# Altium schematic sheet 0269_GPU_VCCGT VREG PHA.SchDoc
size 848 x 558 mm
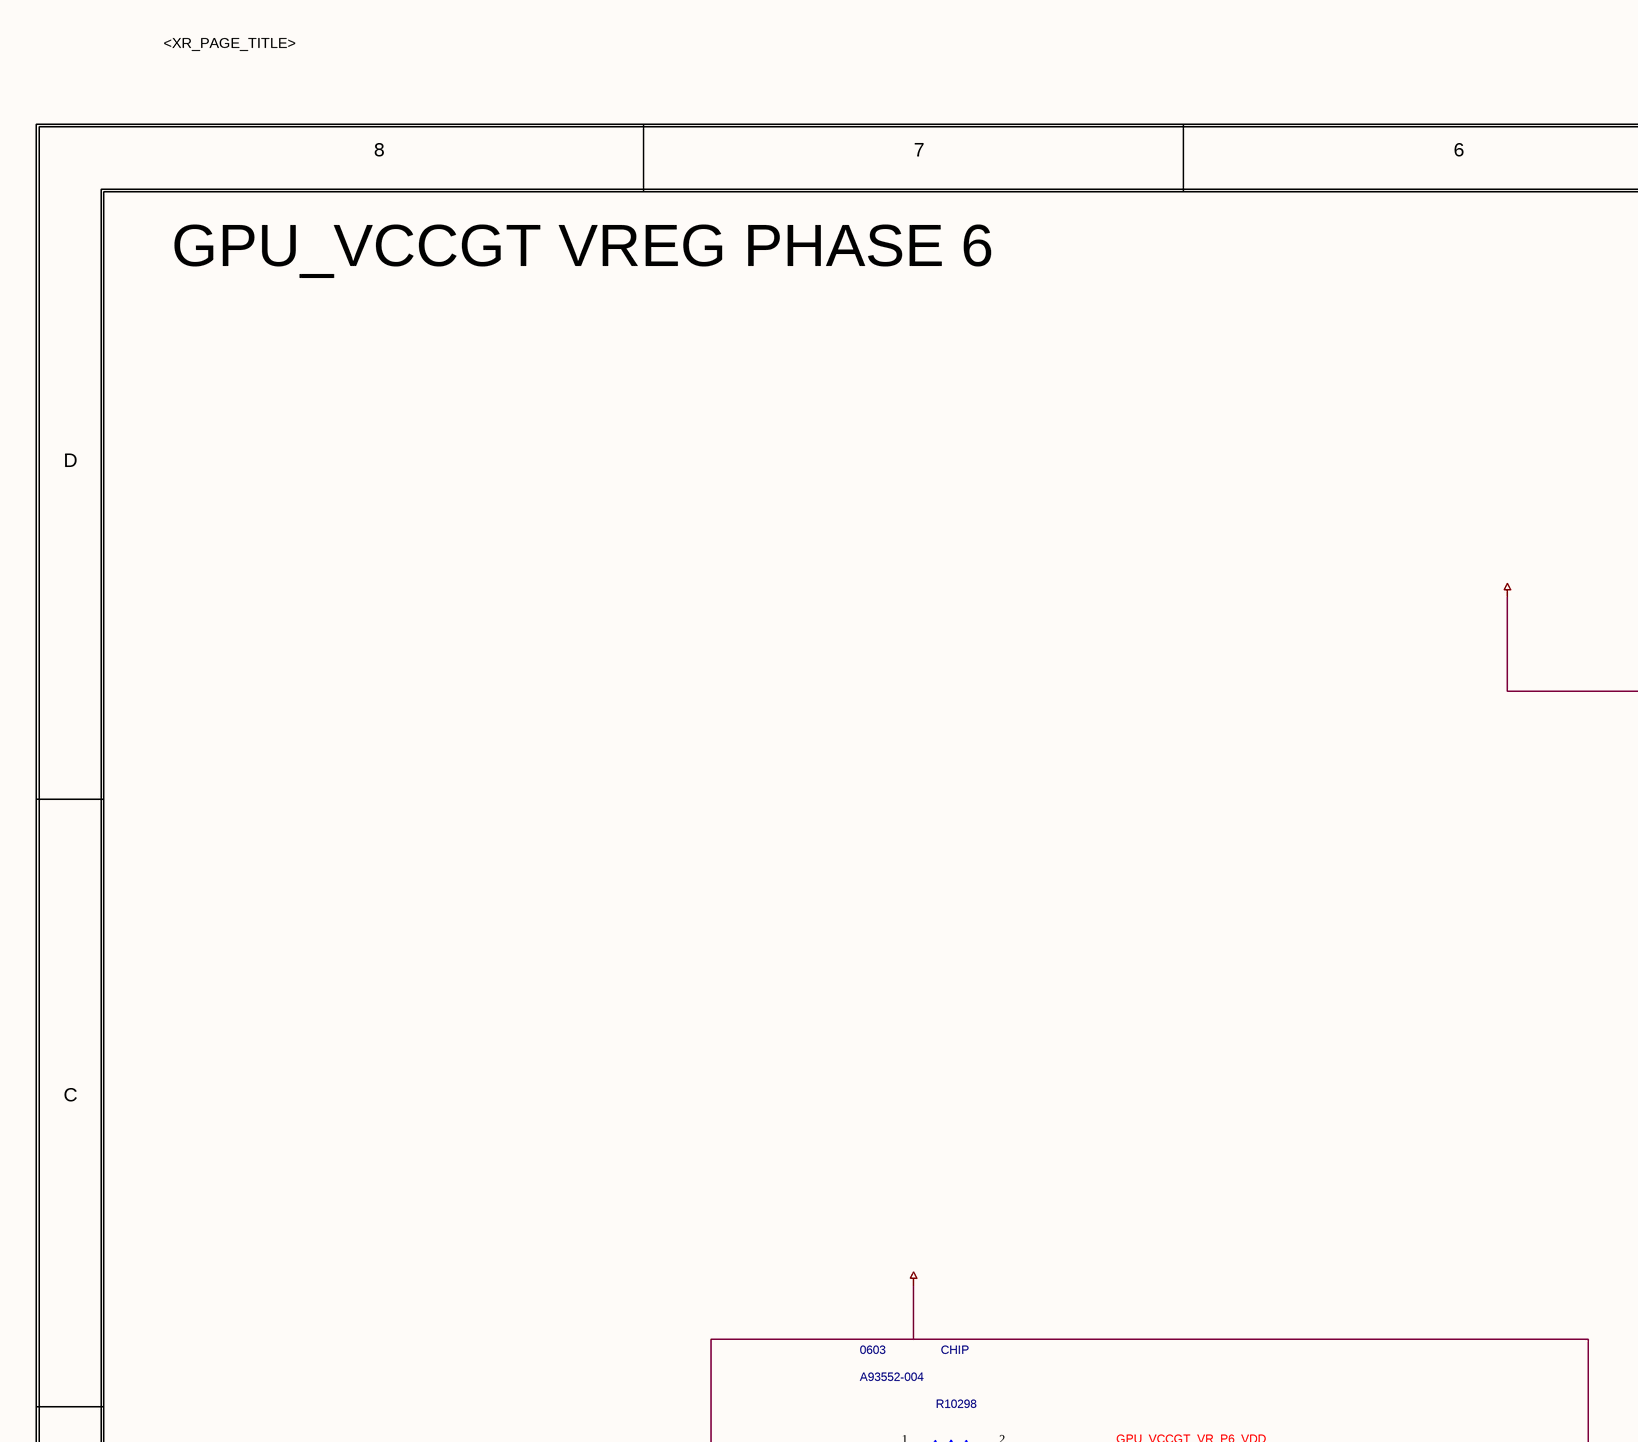
[diagram p0: 0269_GPU_VCCGT VREG PHA.SchDoc, top left]
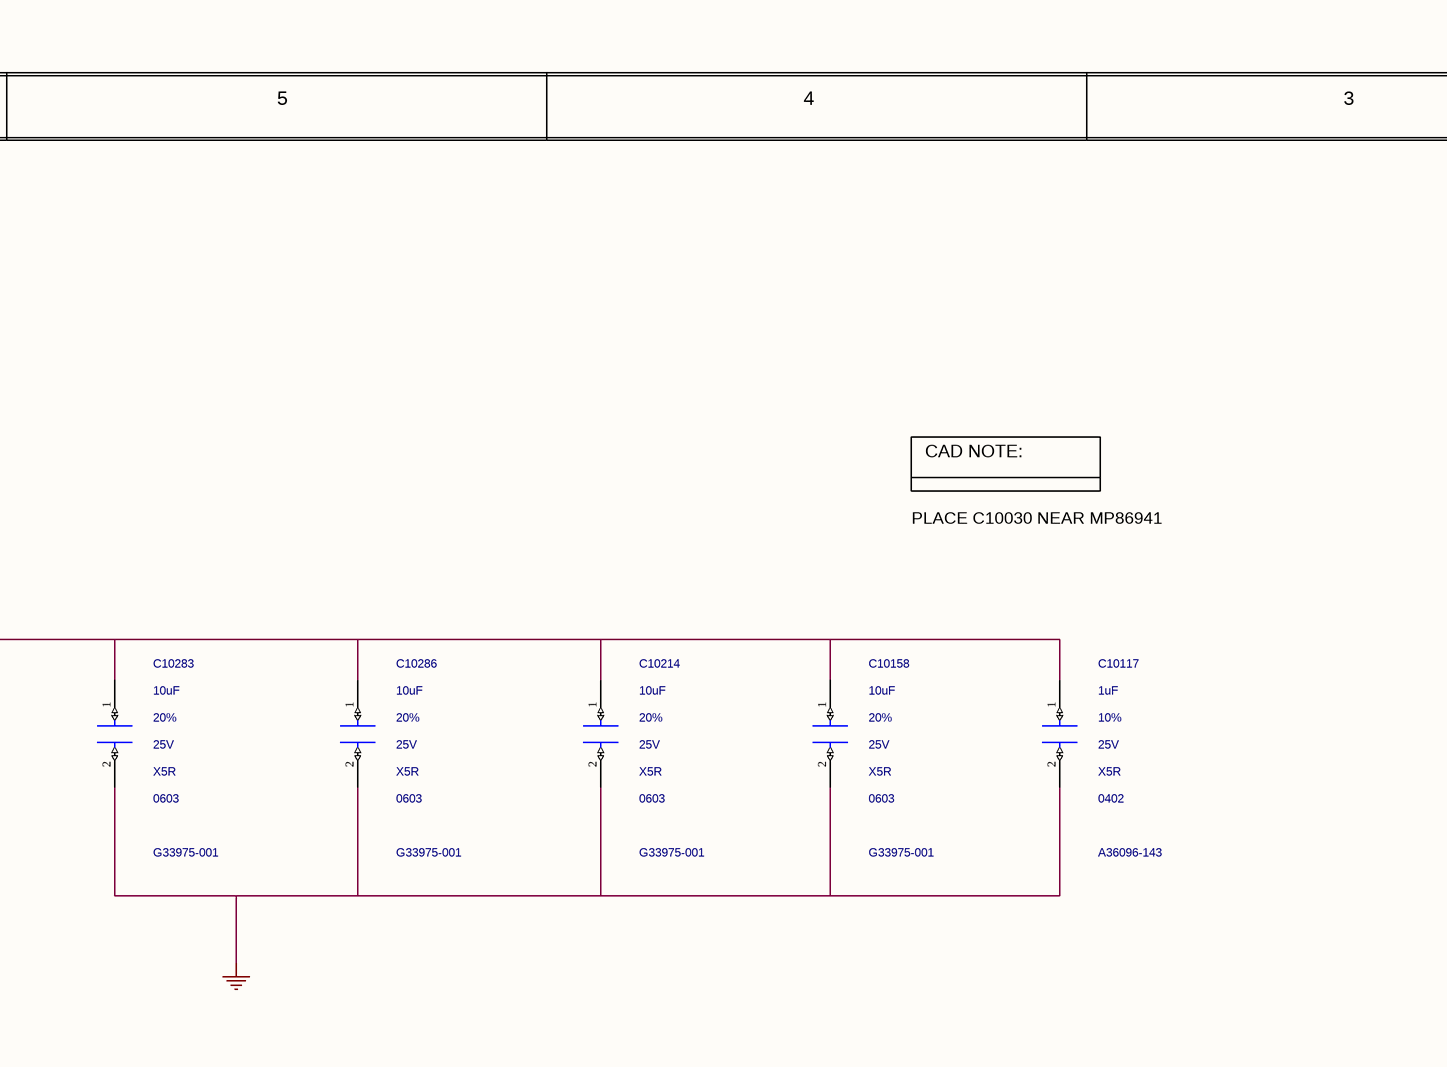
[diagram p1: 0269_GPU_VCCGT VREG PHA.SchDoc, top middle]
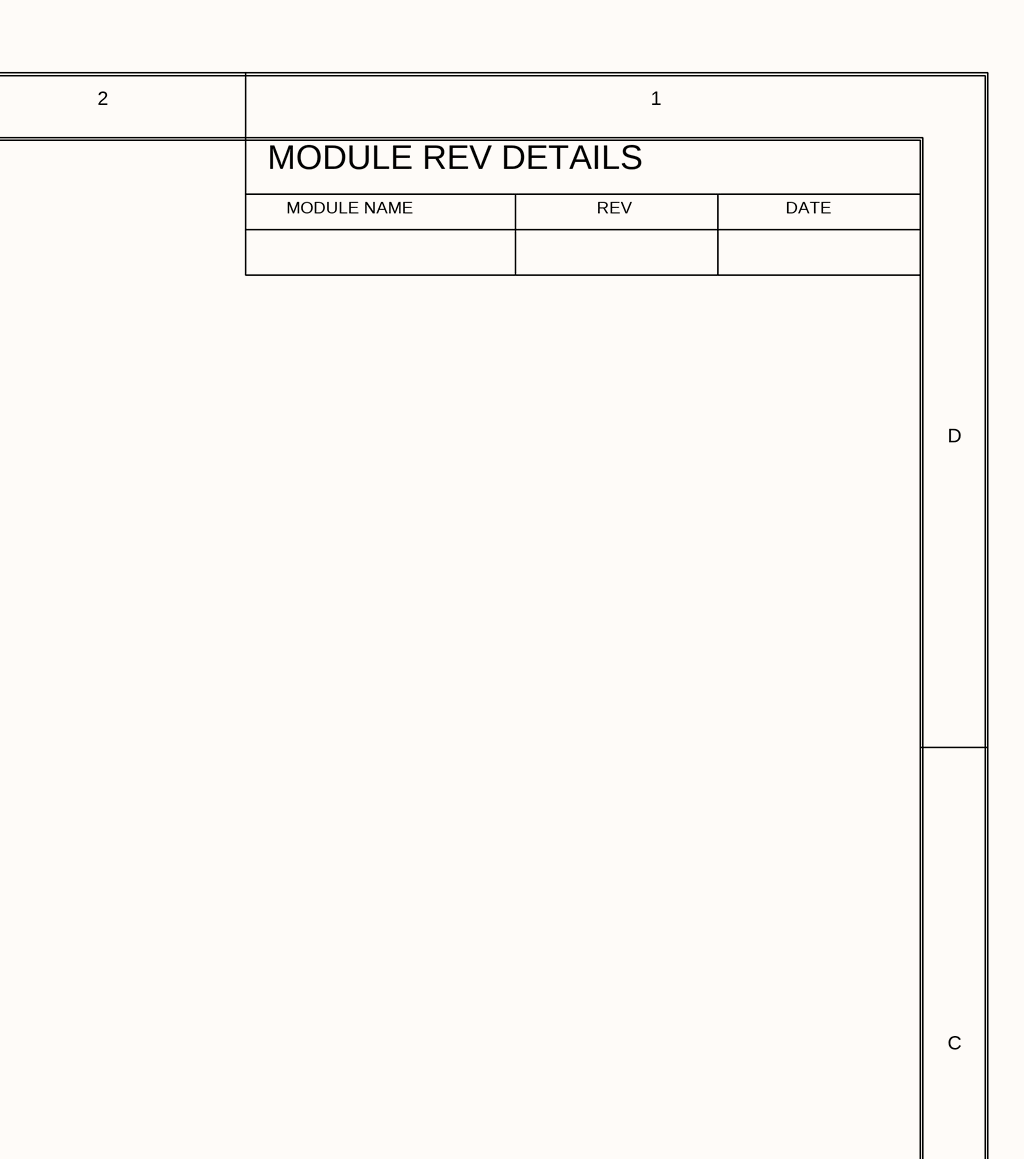
[diagram p2: 0269_GPU_VCCGT VREG PHA.SchDoc, top right]
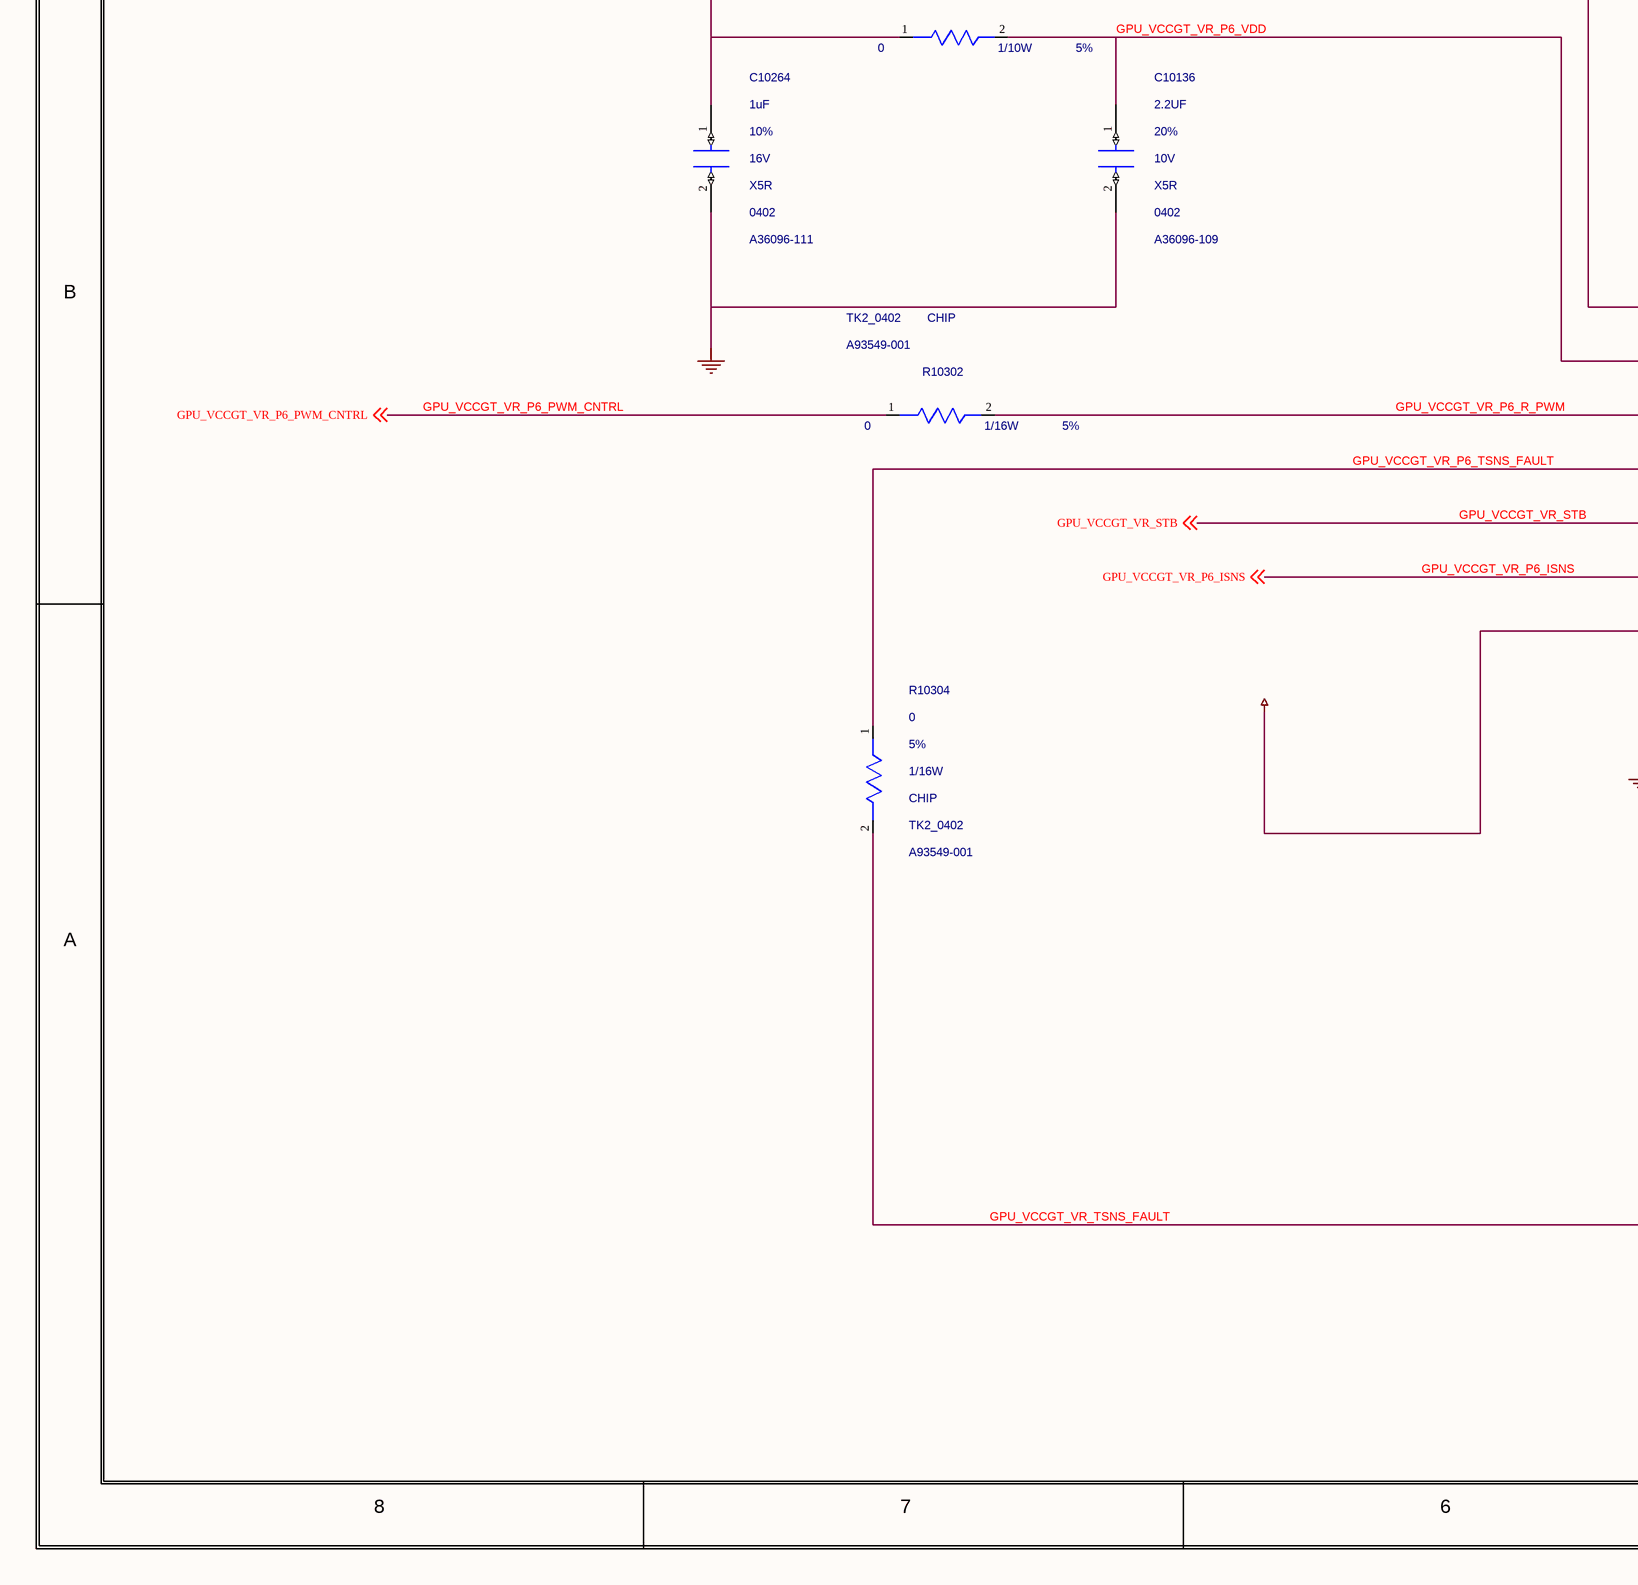
[diagram p3: 0269_GPU_VCCGT VREG PHA.SchDoc, bottom left]
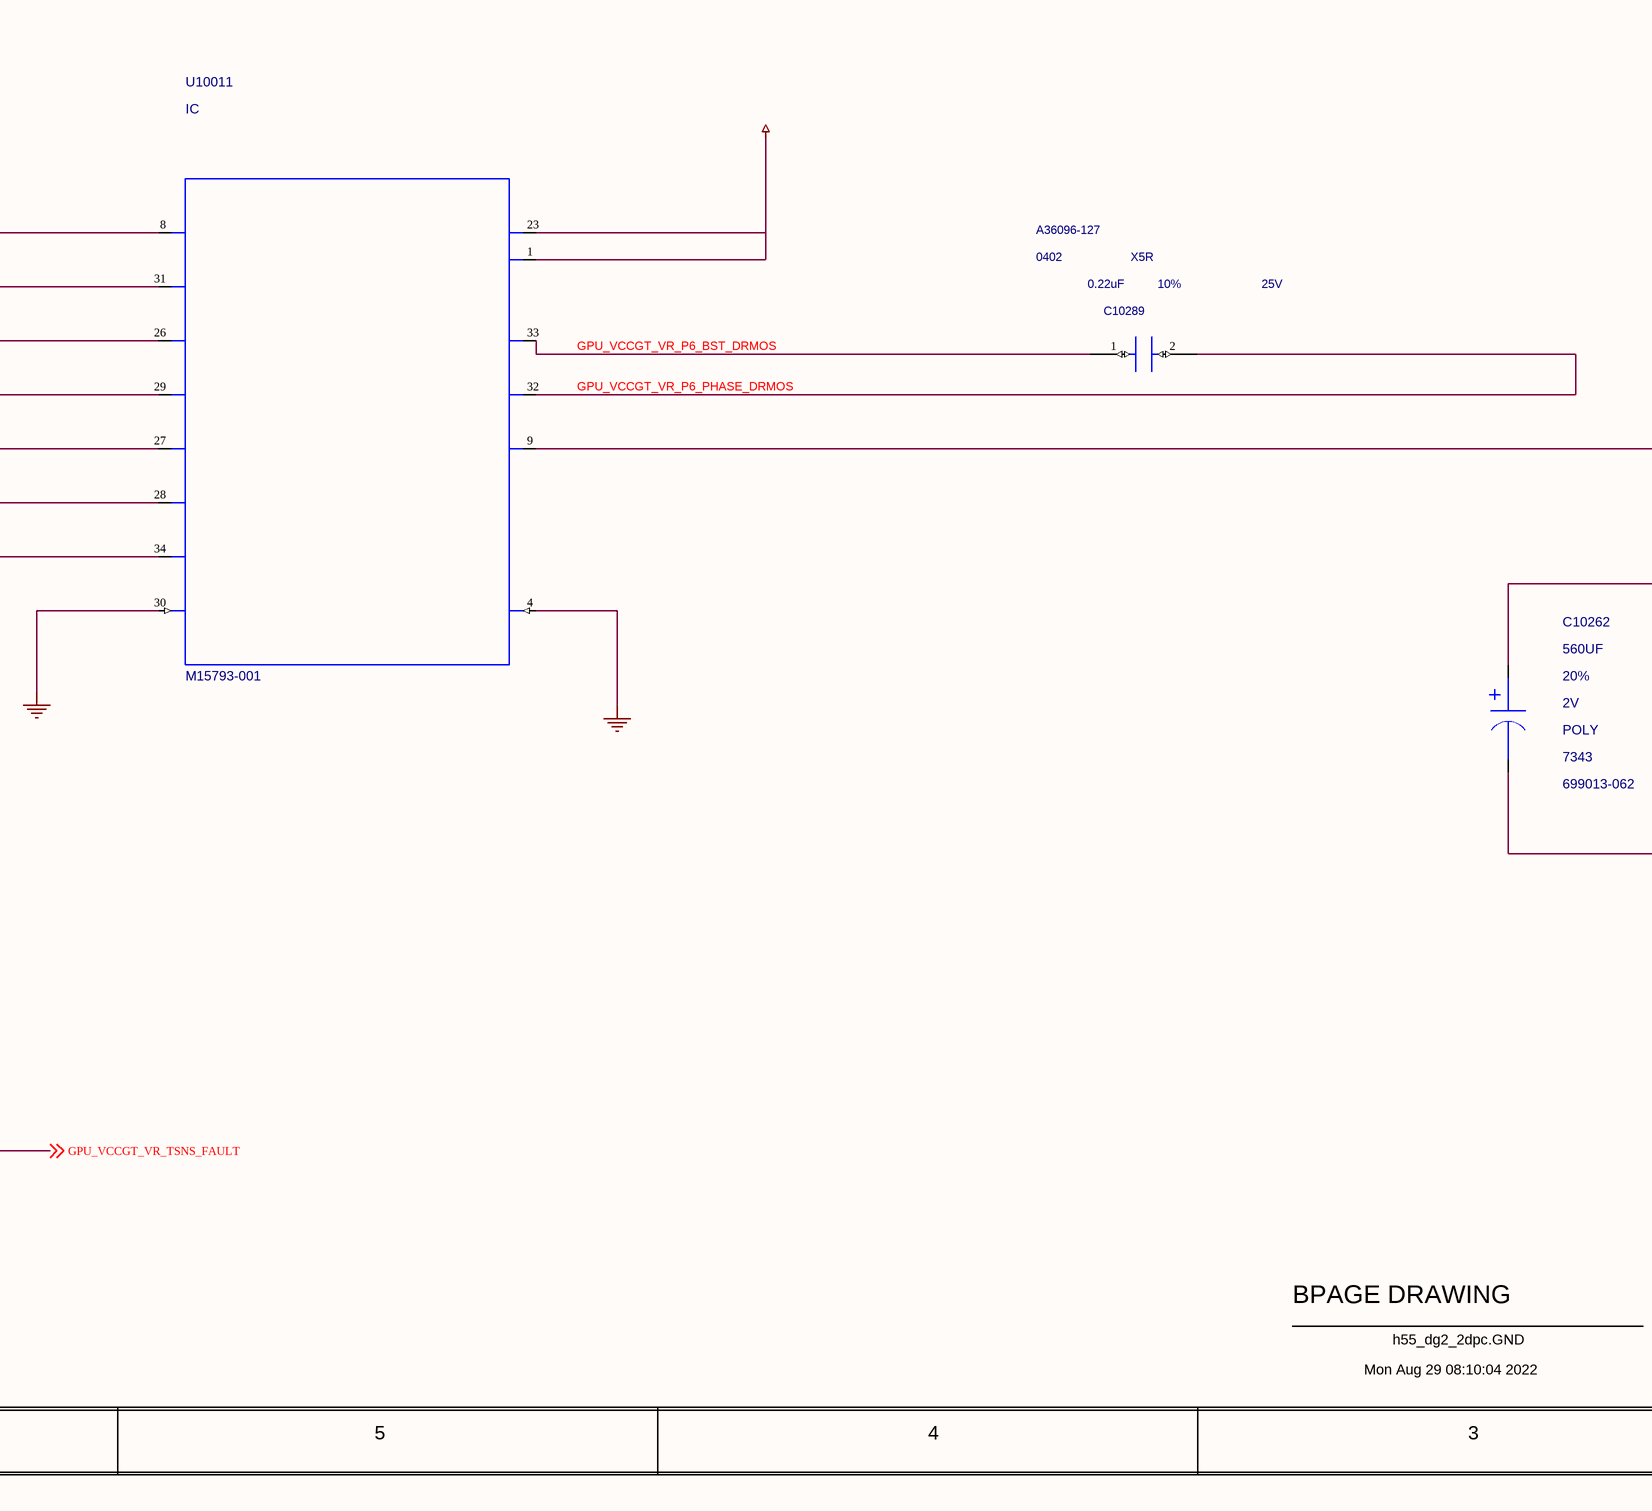
[diagram p4: 0269_GPU_VCCGT VREG PHA.SchDoc, bottom middle]
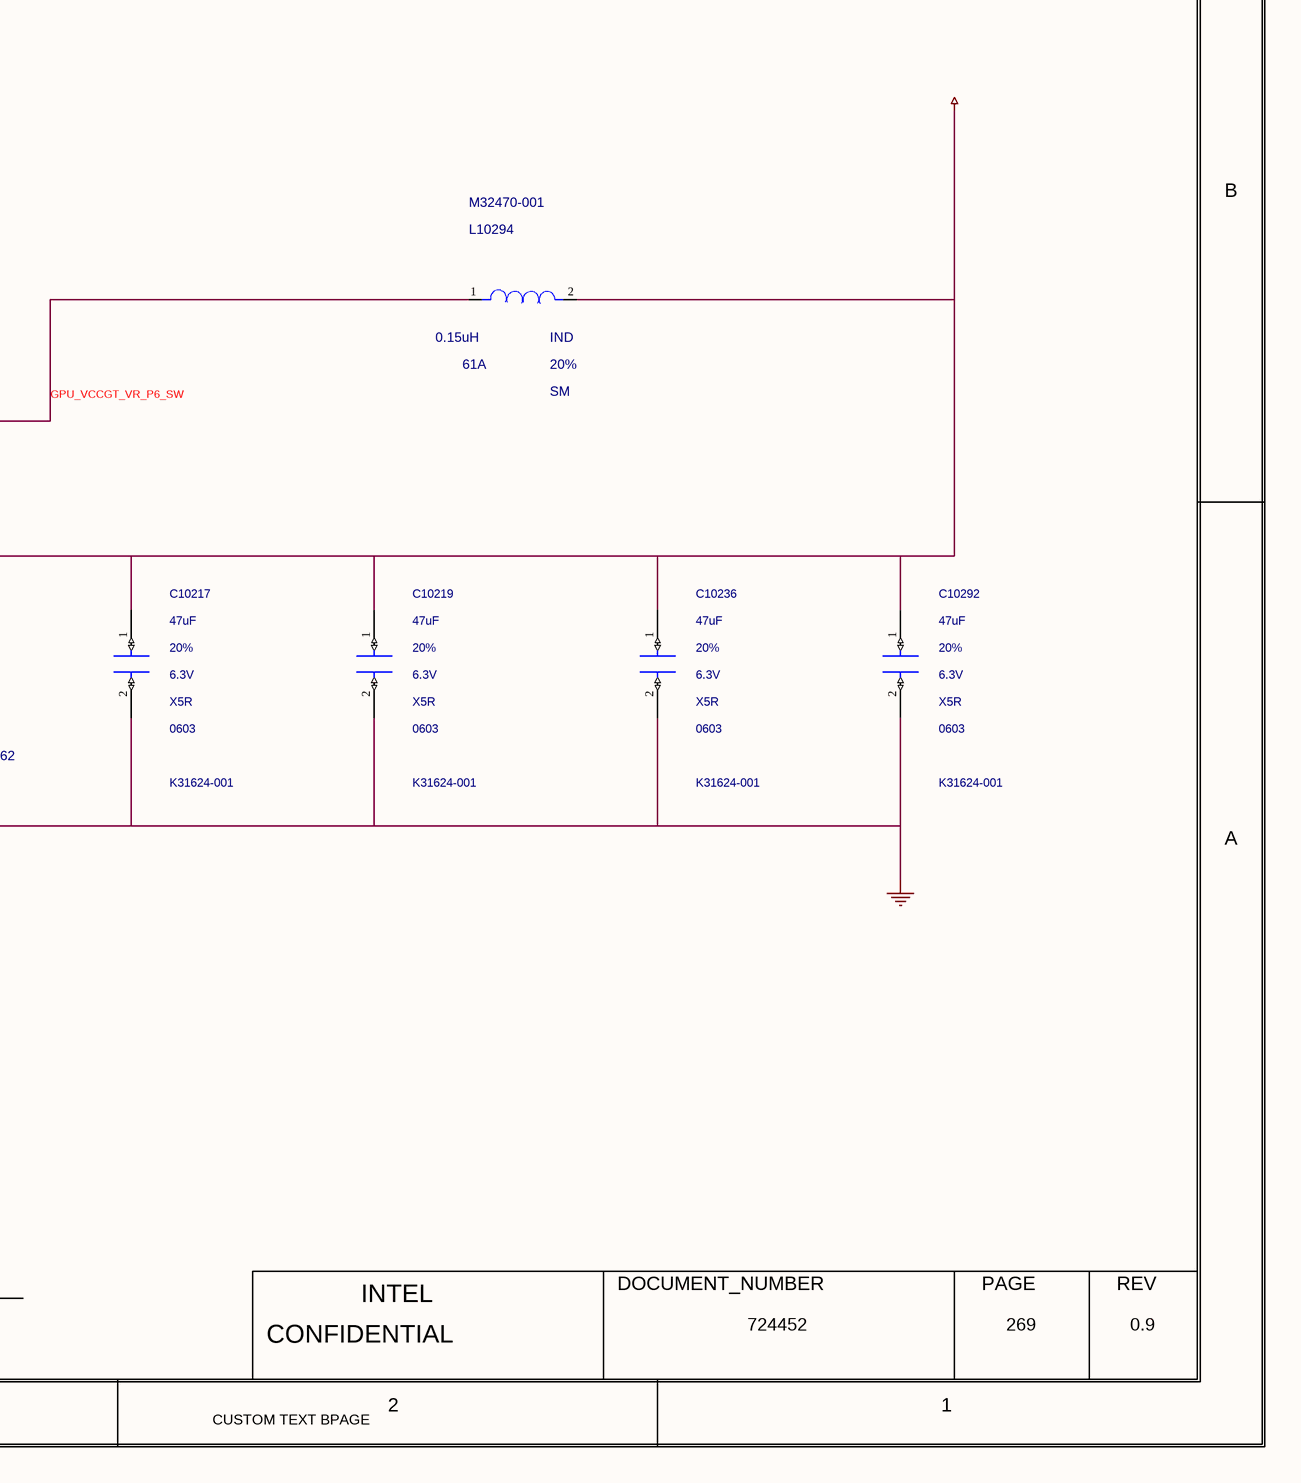
[diagram p5: 0269_GPU_VCCGT VREG PHA.SchDoc, bottom right]

## Parts
C10117  1uF  MATERIAL: X5R  PACK_TYPE: 0402  PART_NUMBER: A36096-143  TOLERANCE: 10%  VOLTAGE: 25V  [SMC0402MA]
C10136  2.2UF  MATERIAL: X5R  PACK_TYPE: 0402  PART_NUMBER: A36096-109  TOLERANCE: 20%  VOLTAGE: 10V  [SMC0402IA]
C10158  10uF  MATERIAL: X5R  PACK_TYPE: 0603  PART_NUMBER: G33975-001  TOLERANCE: 20%  VOLTAGE: 25V  [SMC0603IA]
C10214  10uF  MATERIAL: X5R  PACK_TYPE: 0603  PART_NUMBER: G33975-001  TOLERANCE: 20%  VOLTAGE: 25V  [SMC0603IA]
C10217  47uF  MATERIAL: X5R  PACK_TYPE: 0603  PART_NUMBER: K31624-001  TOLERANCE: 20%  VOLTAGE: 6.3V  [SMC0603ID]
C10219  47uF  MATERIAL: X5R  PACK_TYPE: 0603  PART_NUMBER: K31624-001  TOLERANCE: 20%  VOLTAGE: 6.3V  [SMC0603ID]
C10236  47uF  MATERIAL: X5R  PACK_TYPE: 0603  PART_NUMBER: K31624-001  TOLERANCE: 20%  VOLTAGE: 6.3V  [SMC0603ID]
C10262  560UF  MATERIAL: POLY  PACK_TYPE: 7343  PART_NUMBER: 699013-062  TOLERANCE: 20%  VOLTAGE: 2V  [CTK0_SMC7343M_7500X4500_TANT_MA]
C10264  1uF  MATERIAL: X5R  PACK_TYPE: 0402  PART_NUMBER: A36096-111  TOLERANCE: 10%  VOLTAGE: 16V  [SMC0402IA]
C10283  10uF  MATERIAL: X5R  PACK_TYPE: 0603  PART_NUMBER: G33975-001  TOLERANCE: 20%  VOLTAGE: 25V  [SMC0603IA]
C10286  10uF  MATERIAL: X5R  PACK_TYPE: 0603  PART_NUMBER: G33975-001  TOLERANCE: 20%  VOLTAGE: 25V  [SMC0603IA]
C10289  0.22uF  MATERIAL: X5R  PACK_TYPE: 0402  PART_NUMBER: A36096-127  TOLERANCE: 10%  VOLTAGE: 25V  [SMC1005MB]
C10292  47uF  MATERIAL: X5R  PACK_TYPE: 0603  PART_NUMBER: K31624-001  TOLERANCE: 20%  VOLTAGE: 6.3V  [SMC0603ID]
L10294  0.15uH  CURRENT: 61A  MATERIAL: IND  PACK_TYPE: SM  PART_NUMBER: M32470-001  TOLERANCE: 20%  [CTK2_SM_7300X6800_MA]
R10298  0  MATERIAL: CHIP  PACK_TYPE: 0603  PART_NUMBER: A93552-004  TOLERANCE: 5%  WATTAGE: 1/10W  [SMR0603IA]
R10302  0  MATERIAL: CHIP  PACK_TYPE: TK2_0402  PART_NUMBER: A93549-001  TOLERANCE: 5%  WATTAGE: 1/16W  [SMR1005MB]
R10304  0  MATERIAL: CHIP  PACK_TYPE: TK2_0402  PART_NUMBER: A93549-001  TOLERANCE: 5%  WATTAGE: 1/16W  [SMR1005MB]
U10011  MATERIAL: IC  PART_NUMBER: M15793-001  [CTK1_LCC34_4100X6100_450_DF4P_MA_VR]  (hidden comment: C_MP86959)

## Nets
+V3P3S_GPU: C10264.1(A) R10298.1(A) U10011.8(VDRV) U10011.34(TEST)
+VBATA_VCCGT_GPU: C10117.1(A) C10158.1(A) C10214.1(A) C10283.1(A) C10286.1(A) U10011.1(VIN_1) U10011.23(VIN_2)
+VCCGT_GPU: C10217.1(A) C10219.1(A) C10236.1(A) C10262.1(A) C10292.1(A) L10294.2(INB)
GND: C10117.2(B) C10136.2(B) C10158.2(B) C10214.2(B) C10217.2(B) C10219.2(B) C10236.2(B) C10262.2(B) C10264.2(B) C10283.2(B) C10286.2(B) C10292.2(B) U10011.4(PGND) U10011.30(AGND)
GPU_VCCGT_VR_P6_BST_DRMOS: C10289.1(A) U10011.33(BST)
GPU_VCCGT_VR_P6_ISNS: U10011.28(CS) ; off-sheet GPU_VCCGT_VR_P6_ISNS
GPU_VCCGT_VR_P6_PHASE_DRMOS: C10289.2(B) U10011.32(PHASE)
GPU_VCCGT_VR_P6_PWM_CNTRL: R10302.1(A) ; off-sheet GPU_VCCGT_VR_P6_PWM_CNTRL
GPU_VCCGT_VR_P6_R_PWM: R10302.2(B) U10011.26(PWM)
GPU_VCCGT_VR_P6_SW: L10294.1(INA) U10011.9(SW)
GPU_VCCGT_VR_P6_TSNS_FAULT: R10304.1(A) U10011.29(VTEMP_FLT)
GPU_VCCGT_VR_P6_VDD: C10136.1(A) R10298.2(B) U10011.31(VDD)
GPU_VCCGT_VR_STB: U10011.27(SYNC) ; off-sheet GPU_VCCGT_VR_STB
GPU_VCCGT_VR_TSNS_FAULT: R10304.2(B) ; off-sheet GPU_VCCGT_VR_TSNS_FAULT

## Notes on the sheet
- <XR_PAGE_TITLE>
- 8
- 7
- 6
- 5
- 4
- 3
- 2
- 1
- MODULE REV DETAILS
- GPU_VCCGT VREG PHASE 6
- MODULE NAME
- REV
- DATE
- D
- CAD NOTE:
- PLACE C10030 NEAR MP86941
- C
- B
- A
- BPAGE DRAWING
- INTEL
- DOCUMENT_NUMBER
- PAGE
- Mon Aug 29 08:10:04 2022
- h55_dg2_2dpc.GND
- CONFIDENTIAL
- 724452
- 269
- 0.9
- CUSTOM TEXT BPAGE

## Library data of the parts
C10117 = CAP: CDS_PHYS_PART_NAME: CAP_0402-A36096-143,X5R,1UF,25V,10%,LPDB,GENERIC; OriginalSymbolOrigin: (-50,25); XY: (-3050,3900); VER: 1; ROT: 0; PHYS_PAGE: 269; LOCATION: C10117; DRAWING: @RVP1_ADL_SB_ADP_S_DDR5_SODIMM_2DPC_LIB.H55_DG2_2DPC(SCH_1):PAGE442; CDS_LIB: discrete; PCB Footprint: SMC0402MA; CHIPS_PART_NAME: CAP; CDS_PART_NAME: CAP_0402-A36096-143,X5R,1UF,25V,10%,LPDB,GENERIC; CDS_LOCATION: C10117
C10136 = CAP: CDS_PHYS_PART_NAME: CAP_0402-A36096-109,X5R,2.2UF,10V,20%,LPDB,GENERIC; OriginalSymbolOrigin: (-50,25); XY: (-6125,2450); VER: 1; ROT: 0; PHYS_PAGE: 269; LOCATION: C10136; DRAWING: @RVP1_ADL_SB_ADP_S_DDR5_SODIMM_2DPC_LIB.H55_DG2_2DPC(SCH_1):PAGE442; CDS_LIB: discrete; PCB Footprint: SMC0402IA; CHIPS_PART_NAME: CAP; CDS_PART_NAME: CAP_0402-A36096-109,X5R,2.2UF,10V,20%,LPDB,GENERIC; CDS_LOCATION: C10136
C10158 = CAP: CDS_PHYS_PART_NAME: CAP_0603-G33975-001,X5R,10UF,25V,20%,LPDB,GENERIC; OriginalSymbolOrigin: (-50,25); XY: (-3475,3900); VER: 1; ROT: 0; PHYS_PAGE: 269; LOCATION: C10158; DRAWING: @RVP1_ADL_SB_ADP_S_DDR5_SODIMM_2DPC_LIB.H55_DG2_2DPC(SCH_1):PAGE442; CDS_LIB: discrete; PCB Footprint: SMC0603IA; CHIPS_PART_NAME: CAP; CDS_PART_NAME: CAP_0603-G33975-001,X5R,10UF,25V,20%,LPDB,GENERIC; CDS_LOCATION: C10158
C10214 = CAP: CDS_PHYS_PART_NAME: CAP_0603-G33975-001,X5R,10UF,25V,20%,LPDB,GENERIC; OriginalSymbolOrigin: (-50,25); XY: (-3900,3900); VER: 1; ROT: 0; PHYS_PAGE: 269; LOCATION: C10214; DRAWING: @RVP1_ADL_SB_ADP_S_DDR5_SODIMM_2DPC_LIB.H55_DG2_2DPC(SCH_1):PAGE442; CDS_LIB: discrete; PCB Footprint: SMC0603IA; CHIPS_PART_NAME: CAP; CDS_PART_NAME: CAP_0603-G33975-001,X5R,10UF,25V,20%,LPDB,GENERIC; CDS_LOCATION: C10214
C10217 = CAP: CDS_PHYS_PART_NAME: CAP_0603-K31624-001,X5R,47UF,6.3V,20%,LPDB,GENERIC; OriginalSymbolOrigin: (-50,25); XY: (-1975,1325); VER: 1; ROT: 0; PHYS_PAGE: 269; LOCATION: C10217; DRAWING: @RVP1_ADL_SB_ADP_S_DDR5_SODIMM_2DPC_LIB.H55_DG2_2DPC(SCH_1):PAGE442; CDS_LIB: discrete; PCB Footprint: SMC0603ID; CHIPS_PART_NAME: CAP; CDS_PART_NAME: CAP_0603-K31624-001,X5R,47UF,6.3V,20%,LPDB,GENERIC; CDS_LOCATION: C10217
C10219 = CAP: CDS_PHYS_PART_NAME: CAP_0603-K31624-001,X5R,47UF,6.3V,20%,LPDB,GENERIC; OriginalSymbolOrigin: (-50,25); XY: (-1525,1325); VER: 1; ROT: 0; PHYS_PAGE: 269; LOCATION: C10219; DRAWING: @RVP1_ADL_SB_ADP_S_DDR5_SODIMM_2DPC_LIB.H55_DG2_2DPC(SCH_1):PAGE442; CDS_LIB: discrete; PCB Footprint: SMC0603ID; CHIPS_PART_NAME: CAP; CDS_PART_NAME: CAP_0603-K31624-001,X5R,47UF,6.3V,20%,LPDB,GENERIC; CDS_LOCATION: C10219
C10236 = CAP: CDS_PHYS_PART_NAME: CAP_0603-K31624-001,X5R,47UF,6.3V,20%,LPDB,GENERIC; OriginalSymbolOrigin: (-50,25); XY: (-1000,1325); VER: 1; ROT: 0; PHYS_PAGE: 269; LOCATION: C10236; DRAWING: @RVP1_ADL_SB_ADP_S_DDR5_SODIMM_2DPC_LIB.H55_DG2_2DPC(SCH_1):PAGE442; CDS_LIB: discrete; PCB Footprint: SMC0603ID; CHIPS_PART_NAME: CAP; CDS_PART_NAME: CAP_0603-K31624-001,X5R,47UF,6.3V,20%,LPDB,GENERIC; CDS_LOCATION: C10236
C10262 = C_CAPP: CDS_PHYS_PART_NAME: C_CAPP_7343-699013-062,POLY,560UF,2V,20%,TK0,GENERIC; CDS_LMAN_SYM_OUTLINE: -50,100,50,-50; FP_TECH: TK0; IP: GENERIC; ROOM: NONE; OriginalSymbolOrigin: (-50,75); XY: (-2425,1275); VER: 1; ROT: 0; PHYS_PAGE: 269; LOCATION: C10262; DRAWING: @RVP1_ADL_SB_ADP_S_DDR5_SODIMM_2DPC_LIB.H55_DG2_2DPC(SCH_1):PAGE442; CDS_LIB: c_discrete; VARIANT: ?; PCB Footprint: CTK0_SMC7343M_7500X4500_TANT_MA; CHIPS_PART_NAME: C_CAPP; CDS_PART_NAME: C_CAPP_7343-699013-062,POLY,560UF,2V,20%,TK0,GENERIC; CDS_LOCATION: C10262
C10264 = CAP: CDS_PHYS_PART_NAME: CAP_0402-A36096-111,X5R,1UF,16V,10%,LPDB,GENERIC; OriginalSymbolOrigin: (-50,25); XY: (-6875,2450); VER: 1; ROT: 0; PHYS_PAGE: 269; LOCATION: C10264; DRAWING: @RVP1_ADL_SB_ADP_S_DDR5_SODIMM_2DPC_LIB.H55_DG2_2DPC(SCH_1):PAGE442; CDS_LIB: discrete; PCB Footprint: SMC0402IA; CHIPS_PART_NAME: CAP; CDS_PART_NAME: CAP_0402-A36096-111,X5R,1UF,16V,10%,LPDB,GENERIC; CDS_LOCATION: C10264
C10283 = CAP: CDS_PHYS_PART_NAME: CAP_0603-G33975-001,X5R,10UF,25V,20%,LPDB,GENERIC; OriginalSymbolOrigin: (-50,25); XY: (-4800,3900); VER: 1; ROT: 0; PHYS_PAGE: 269; LOCATION: C10283; DRAWING: @RVP1_ADL_SB_ADP_S_DDR5_SODIMM_2DPC_LIB.H55_DG2_2DPC(SCH_1):PAGE442; CDS_LIB: discrete; PCB Footprint: SMC0603IA; CHIPS_PART_NAME: CAP; CDS_PART_NAME: CAP_0603-G33975-001,X5R,10UF,25V,20%,LPDB,GENERIC; CDS_LOCATION: C10283
C10286 = CAP: CDS_PHYS_PART_NAME: CAP_0603-G33975-001,X5R,10UF,25V,20%,LPDB,GENERIC; OriginalSymbolOrigin: (-50,25); XY: (-4350,3900); VER: 1; ROT: 0; PHYS_PAGE: 269; LOCATION: C10286; DRAWING: @RVP1_ADL_SB_ADP_S_DDR5_SODIMM_2DPC_LIB.H55_DG2_2DPC(SCH_1):PAGE442; CDS_LIB: discrete; PCB Footprint: SMC0603IA; CHIPS_PART_NAME: CAP; CDS_PART_NAME: CAP_0603-G33975-001,X5R,10UF,25V,20%,LPDB,GENERIC; CDS_LOCATION: C10286
C10289 = CAP#1: CHIPS_PART_NAME: CAP; CDS_PHYS_PART_NAME: CAP_0402-A36096-127,X5R,0.22UF,25V,10%,LPDB,GENERIC; OriginalSymbolOrigin: (-25,50); XY: (-3100,1950); VER: 2; ROT: 0; PHYS_PAGE: 269; LOCATION: C10289; DRAWING: @RVP1_ADL_SB_ADP_S_DDR5_SODIMM_2DPC_LIB.H55_DG2_2DPC(SCH_1):PAGE442; CDS_LIB: discrete; PCB Footprint: SMC1005MB; CDS_PART_NAME: CAP_0402-A36096-127,X5R,0.22UF,25V,10%,LPDB,GENERIC; CDS_LOCATION: C10289
C10292 = CAP: CDS_PHYS_PART_NAME: CAP_0603-K31624-001,X5R,47UF,6.3V,20%,LPDB,GENERIC; OriginalSymbolOrigin: (-50,25); XY: (-550,1325); VER: 1; ROT: 0; PHYS_PAGE: 269; LOCATION: C10292; DRAWING: @RVP1_ADL_SB_ADP_S_DDR5_SODIMM_2DPC_LIB.H55_DG2_2DPC(SCH_1):PAGE442; CDS_LIB: discrete; PCB Footprint: SMC0603ID; CHIPS_PART_NAME: CAP; CDS_PART_NAME: CAP_0603-K31624-001,X5R,47UF,6.3V,20%,LPDB,GENERIC; CDS_LOCATION: C10292
L10294 = C_INDUCTOR: CDS_PHYS_PART_NAME: C_INDUCTOR_SM-M32470-001,IND,0.15UH,20%,61A,TK2,GENERIC; CDS_LMAN_SYM_OUTLINE: -100,50,100,-50; FP_TECH: TK2; IP: GENERIC; ROOM: NONE; OriginalSymbolOrigin: (-75,25); XY: (-1250,2000); VER: 1; ROT: 0; PHYS_PAGE: 269; LOCATION: L10294; DRAWING: @RVP1_ADL_SB_ADP_S_DDR5_SODIMM_2DPC_LIB.H55_DG2_2DPC(SCH_1):PAGE442; CDS_LIB: local; VARIANT: ?; PCB Footprint: CTK2_SM_7300X6800_MA; CHIPS_PART_NAME: C_INDUCTOR; CDS_PART_NAME: C_INDUCTOR_SM-M32470-001,IND,0.15UH,20%,61A,TK2,GENERIC; CDS_LOCATION: L10294
R10298 = RES#1: CHIPS_PART_NAME: RES; CDS_PHYS_PART_NAME: RES_0603-A93552-004,CHIP,0,5%,1/10W,LPDB,GENERIC; OriginalSymbolOrigin: (-75,25); XY: (-6425,2675); VER: 1; PHYS_PAGE: 269; LOCATION: R10298; IP: GENERIC; FP_TECH: LPDB; DRAWING: @RVP1_ADL_SB_ADP_S_DDR5_SODIMM_2DPC_LIB.H55_DG2_2DPC(SCH_1):PAGE442; CDS_LIB: discrete; PCB Footprint: SMR0603IA; ROT: 0; CDS_PART_NAME: RES_0603-A93552-004,CHIP,0,5%,1/10W,LPDB,GENERIC; CDS_LOCATION: R10298
R10302 = RES#1: CHIPS_PART_NAME: RES; CDS_PHYS_PART_NAME: RES_TK2_0402-A93549-001,CHIP,0,5%,1/16W,TK2,GENERIC; OriginalSymbolOrigin: (-75,25); XY: (-6450,1975); VER: 1; PHYS_PAGE: 269; LOCATION: R10302; IP: GENERIC; FP_TECH: TK2; DRAWING: @RVP1_ADL_SB_ADP_S_DDR5_SODIMM_2DPC_LIB.H55_DG2_2DPC(SCH_1):PAGE442; CDS_LIB: discrete; PCB Footprint: SMR1005MB; ROT: 0; CDS_PART_NAME: RES_TK2_0402-A93549-001,CHIP,0,5%,1/16W,TK2,GENERIC; CDS_LOCATION: R10302
R10304 = RES: CDS_PHYS_PART_NAME: RES_TK2_0402-A93549-001,CHIP,0,5%,1/16W,TK2,GENERIC; OriginalSymbolOrigin: (-25,75); XY: (-6575,1300); VER: 2; SUB_ROOM: VCCSA; PHYS_PAGE: 269; LOCATION: R10304; IP: GENERIC; FP_TECH: TK2; DRAWING: @RVP1_ADL_SB_ADP_S_DDR5_SODIMM_2DPC_LIB.H55_DG2_2DPC(SCH_1):PAGE442; CDS_LIB: discrete; PCB Footprint: SMR1005MB; ROT: 0; CHIPS_PART_NAME: RES; CDS_PART_NAME: RES_TK2_0402-A93549-001,CHIP,0,5%,1/16W,TK2,GENERIC; CDS_LOCATION: R10304
U10011 = C_MP86959: CDS_PHYS_PART_NAME: C_MP86959_LCC-M15793-001,IC,MP86959GMW,TK1,GENERIC; CDS_LMAN_SYM_OUTLINE: -300,450,300,-450; FP_TECH: TK1; IP: GENERIC; PACK_TYPE: LCC; ROOM: NONE; OriginalSymbolOrigin: (-325,450); XY: (-4575,1825); VER: 1; ROT: 0; PHYS_PAGE: 269; LOCATION: U10011; DRAWING: @RVP1_ADL_SB_ADP_S_DDR5_SODIMM_2DPC_LIB.H55_DG2_2DPC(SCH_1):PAGE442; CDS_LIB: local; VARIANT: ?; PCB Footprint: CTK1_LCC34_4100X6100_450_DF4P_MA_VR; SEC_TYPE: LCC; CHIPS_PART_NAME: C_MP86959; CDS_PART_NAME: C_MP86959_LCC-M15793-001,IC,MP86959GMW,TK1,GENERIC; CDS_LOCATION: U10011